# EAGLE board TiLDA Mk2 Prototype v0.1 (EAGLE 6.1), part 1 of 3
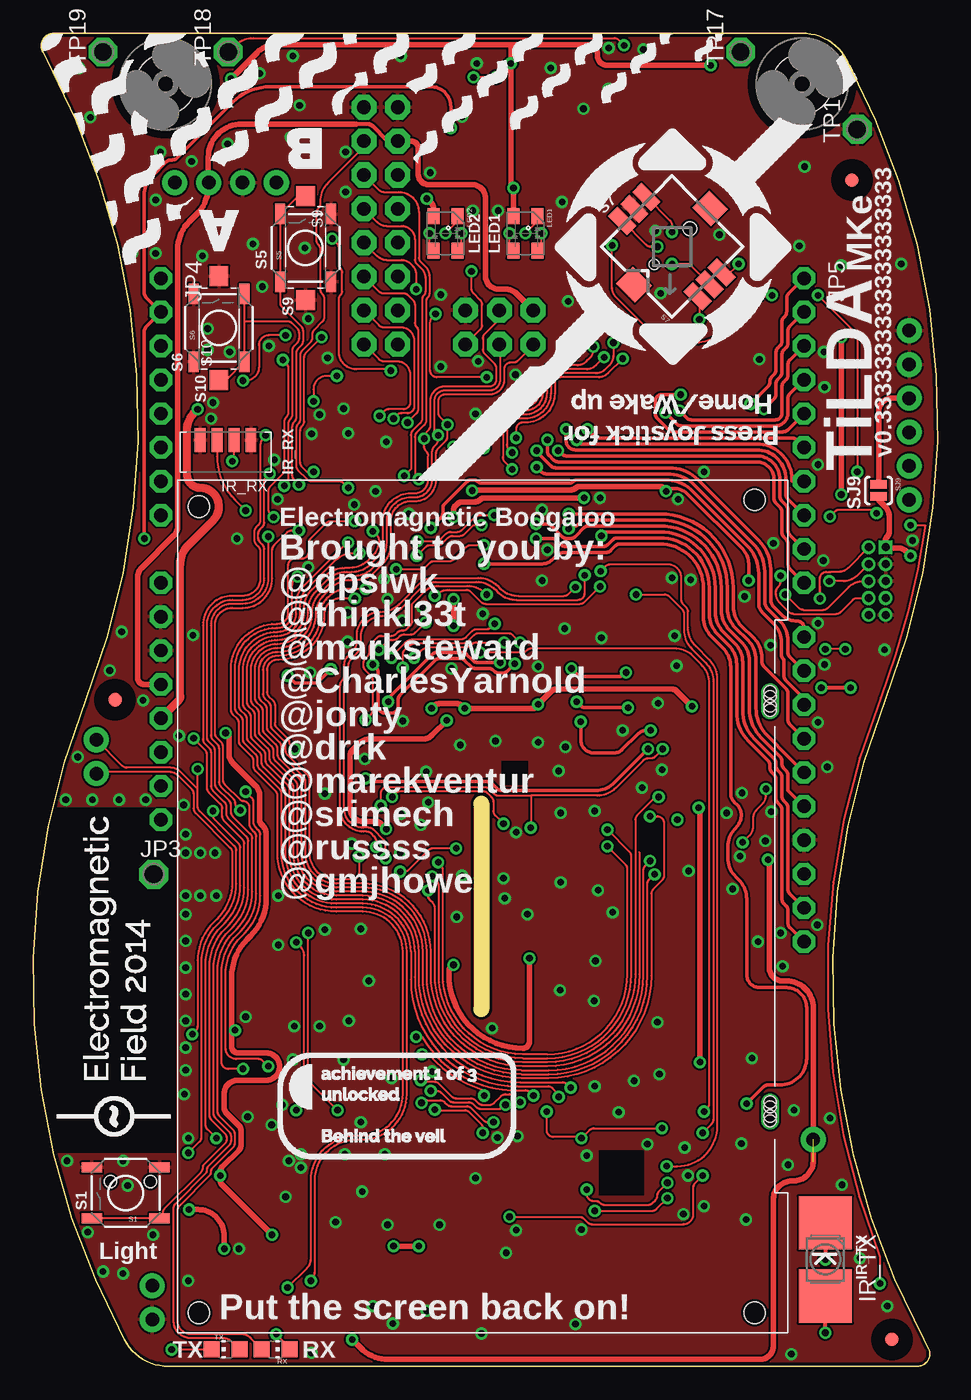
[diagram p5: board, top side]
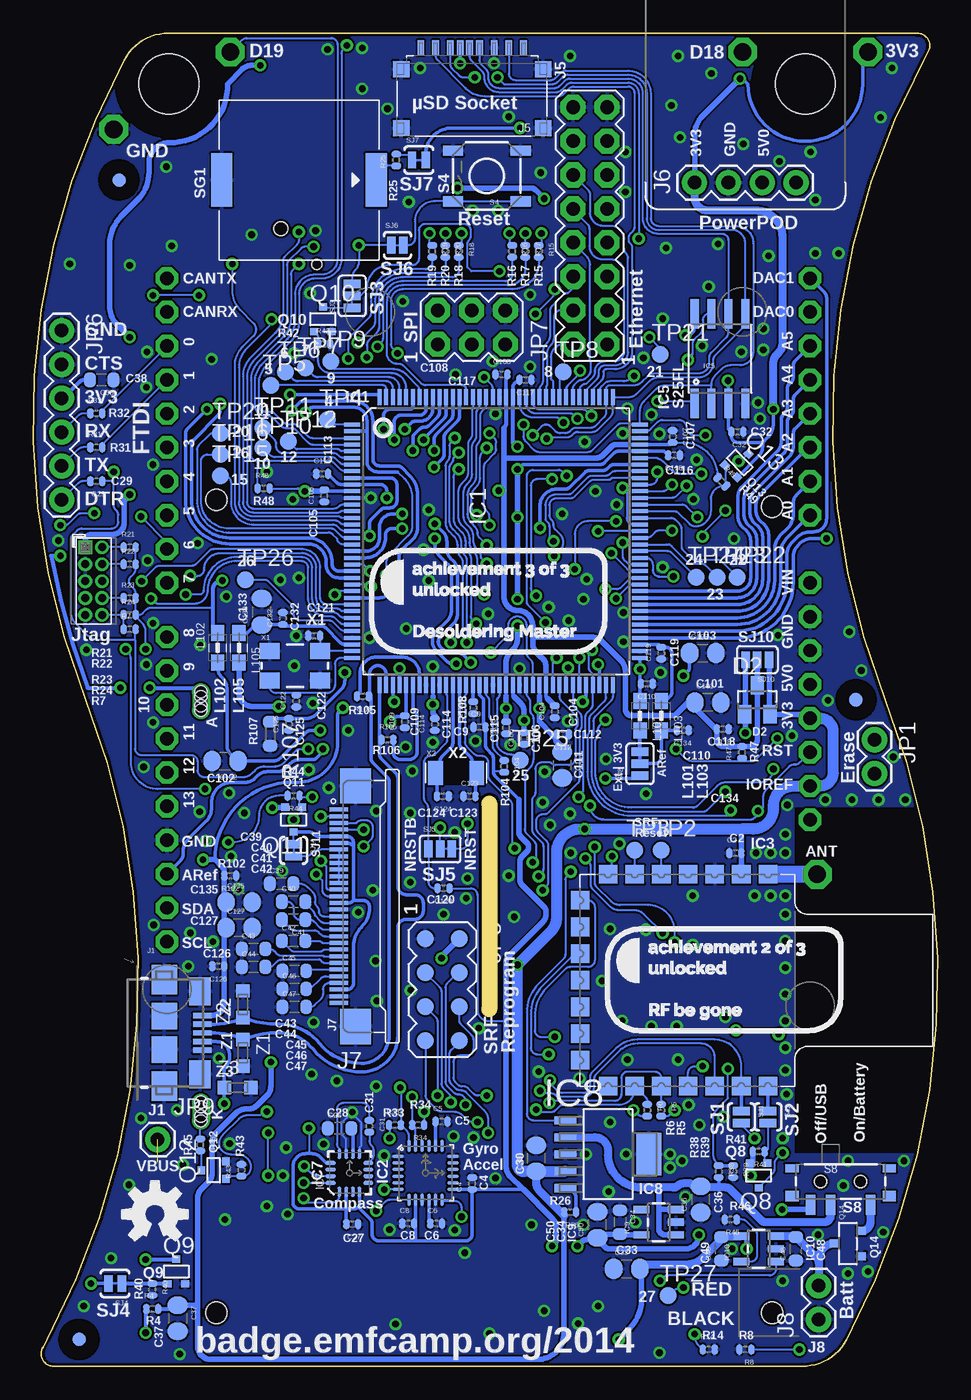
[diagram p6: board, bottom side, seen from below]

Size 67.86 x 100 mm. Coordinates in mm from the lower left corner, seen from the top.
Outline: 33.63,42.2 33.63,26.8
Copper layers (1*2*15*16): Top 0.035mm / dielectric 0.2mm / Route2 0.035mm / dielectric 1mm / Route15 0.035mm / dielectric 0.2mm / Bottom 0.035mm
Design rules: minimum track width 0.15mm, minimum drill 0.3mm, track to track 0.15mm, track to pad 0.15mm, pad to pad 0.15mm, via to via 0.15mm, smd to smd 0.15mm, copper to edge 0.2mm, drill to drill 12mil, minimum pad ring 8mil, minimum via ring 8mil, stop-mask expansion 2mil, vias tented up to drill 25mil, thermal gap 0.15mm
Net classes: 0 default: width 0.15 mm, drill 0.3 mm, clearance 0.15 mm; 1 USB: width 0.254 mm, drill 0.4 mm, clearance 0.2 mm to class 0, clearance 0.4 mm; 2 GND: width 0.3 mm, drill 0.4 mm, clearance 0.2 mm to class 0, clearance 0.2 mm; 3 USBVCC: width 0.6 mm, drill 0.5 mm, clearance 0.2 mm to class 0, clearance 0.2 mm; 4 ANT: width 1.27 mm, drill 0.5 mm, clearance 0.35 mm to class 0, clearance 0.35 mm to class 1, clearance 0.35 mm to class 2, clearance 0.35 mm to class 3, clearance 0.35 mm; 5 CAP: width 0.15 mm, drill 0.5 mm, clearance 0.8 mm to class 0, clearance 0.8 mm to class 1, clearance 0.8 mm to class 2, clearance 0.8 mm to class 3, clearance 0.8 mm to class 4, clearance 0.8 mm
tRestrict: area 0.3,33.9 to 10.7,41.9; area 0.3,16 to 10.7,24
bRestrict: area 0.3,33.9 to 10.7,41.9; area 0.3,16 to 10.7,24

## Footprints (pad centres in the part's own frame; a part is rotated, then mirrored left to right if it is on the bottom)
C0402-ARDUINO-ROUND = smd 0.508 x 0.762: 1 -0.445,0; 2 0.445,0
C0603-ROUND = smd 0.898 x 1.1: 1 -0.889,0; 2 0.889,0
C0805RND = smd 1.3 x 1.5: 1 -0.977,0; 2 0.977,0
C0805RNDPOL = smd 1.3 x 1.5: + -0.977,0; - 0.977,0
SOT23 = smd 1 x 1.4: 1 -0.95,-1.1; 2 0.95,-1.1; 3 0,1.1
FIDUCIAL-1X2.5-STOP = smd 1 x 1: 1 0,0
4,5-LWK = hole 4.5: 0,0
LQFP144 = smd 0.3 x 1.2: 1 -8.75,-10.8; 2 -8.25,-10.8; 3 -7.75,-10.8; 4 -7.25,-10.8; 5 -6.75,-10.8; 6 -6.25,-10.8; 7 -5.75,-10.8; 8 -5.25,-10.8; 9 -4.75,-10.8; 10 -4.25,-10.8; 11 -3.75,-10.8; 12 -3.25,-10.8; 13 -2.75,-10.8; 14 -2.25,-10.8; 15 -1.75,-10.8; 16 -1.25,-10.8; 17 -0.75,-10.8; 18 -0.25,-10.8; 19 0.25,-10.8; 20 0.75,-10.8; 21 1.25,-10.8; 22 1.75,-10.8; 23 2.25,-10.8; 24 2.75,-10.8; 25 3.25,-10.8; 26 3.75,-10.8; 27 4.25,-10.8; 28 4.75,-10.8; 29 5.25,-10.8; 30 5.75,-10.8; 31 6.25,-10.8; 32 6.75,-10.8; 33 7.25,-10.8; 34 7.75,-10.8; 35 8.25,-10.8; 36 8.75,-10.8; 73 8.75,10.8; 74 8.25,10.8; 75 7.75,10.8; 76 7.25,10.8; 77 6.75,10.8; 78 6.25,10.8; 79 5.75,10.8; 80 5.25,10.8; 81 4.75,10.8; 82 4.25,10.8; 83 3.75,10.8; 84 3.25,10.8; 85 2.75,10.8; 86 2.25,10.8; 87 1.75,10.8; 88 1.25,10.8; 89 0.75,10.8; 90 0.25,10.8; 91 -0.25,10.8; 92 -0.75,10.8; 93 -1.25,10.8; 94 -1.75,10.8; 95 -2.25,10.8; 96 -2.75,10.8; 97 -3.25,10.8; 98 -3.75,10.8; 99 -4.25,10.8; 100 -4.75,10.8; 101 -5.25,10.8; 102 -5.75,10.8; 103 -6.25,10.8; 104 -6.75,10.8; 105 -7.25,10.8; 106 -7.75,10.8; 107 -8.25,10.8; 108 -8.75,10.8 | smd 1.2 x 0.3: 37 10.8,-8.75; 38 10.8,-8.25; 39 10.8,-7.75; 40 10.8,-7.25; 41 10.8,-6.75; 42 10.8,-6.25; 43 10.8,-5.75; 44 10.8,-5.25; 45 10.8,-4.75; 46 10.8,-4.25; 47 10.8,-3.75; 48 10.8,-3.25; 49 10.8,-2.75; 50 10.8,-2.25; 51 10.8,-1.75; 52 10.8,-1.25; 53 10.8,-0.75; 54 10.8,-0.25; 55 10.8,0.25; 56 10.8,0.75; 57 10.8,1.25; 58 10.8,1.75; 59 10.8,2.25; 60 10.8,2.75; 61 10.8,3.25; 62 10.8,3.75; 63 10.8,4.25; 64 10.8,4.75; 65 10.8,5.25; 66 10.8,5.75; 67 10.8,6.25; 68 10.8,6.75; 69 10.8,7.25; 70 10.8,7.75; 71 10.8,8.25; 72 10.8,8.75; 109 -10.8,8.75; 110 -10.8,8.25; 111 -10.8,7.75; 112 -10.8,7.25; 113 -10.8,6.75; 114 -10.8,6.25; 115 -10.8,5.75; 116 -10.8,5.25; 117 -10.8,4.75; 118 -10.8,4.25; 119 -10.8,3.75; 120 -10.8,3.25; 121 -10.8,2.75; 122 -10.8,2.25; 123 -10.8,1.75; 124 -10.8,1.25; 125 -10.8,0.75; 126 -10.8,0.25; 127 -10.8,-0.25; 128 -10.8,-0.75; 129 -10.8,-1.25; 130 -10.8,-1.75; 131 -10.8,-2.25; 132 -10.8,-2.75; 133 -10.8,-3.25; 134 -10.8,-3.75; 135 -10.8,-4.25; 136 -10.8,-4.75; 137 -10.8,-5.25; 138 -10.8,-5.75; 139 -10.8,-6.25; 140 -10.8,-6.75; 141 -10.8,-7.25; 142 -10.8,-7.75; 143 -10.8,-8.25; 144 -10.8,-8.75
QFN-24-NODIE = smd 0.85 x 0.25: 1 -2.05,1.25; 2 -2.05,0.75; 3 -2.05,0.25; 4 -2.05,-0.25; 5 -2.05,-0.75; 6 -2.05,-1.25; 13 2.05,-1.25; 14 2.05,-0.75; 15 2.05,-0.25; 16 2.05,0.25; 17 2.05,0.75; 18 2.05,1.25 | smd 0.25 x 0.9: 7 -1.25,-2.025; 8 -0.75,-2.025; 9 -0.25,-2.025; 10 0.25,-2.025; 11 0.75,-2.025; 12 1.25,-2.025; 19 1.25,2.025; 20 0.75,2.025; 21 0.25,2.025; 22 -0.25,2.025; 23 -0.75,2.025; 24 -1.25,2.025
SRF-LANDING-1.2 = smd 1.4 x 1.4: 1 15.9,2; 2 15.9,4; 3 15.9,6; 4 15.9,8; 5 15.9,10; 6 15.9,12; 7 15.9,14; 8 0,14; 9 0,12; 10 0,10; 11 0,8; 12 0,6; 13 0,4; 14 0,2; 15 1.95,-0.1; 16 3.95,-0.1; 17 5.95,-0.1; 18 7.95,-0.1; 19 9.95,-0.1; 20 11.95,-0.1; 21 13.95,-0.1
SO08-EIAJ = smd 0.61 x 2.21: 1 -1.905,-3.378; 2 -0.635,-3.378; 3 0.635,-3.378; 4 1.905,-3.378; 5 1.905,3.353; 6 0.635,3.353; 7 -0.635,3.353; 8 -1.905,3.353
16LPCC = smd 0.75 x 0.28: 1 -1.42,0.75; 2 -1.42,0.25; 3 -1.42,-0.25; 4 -1.42,-0.75; 9 1.42,-0.75; 10 1.42,-0.25; 11 1.42,0.25; 12 1.42,0.75 | smd 0.28 x 0.75: 5 -0.75,-1.42; 6 -0.25,-1.42; 7 0.25,-1.42; 8 0.75,-1.42; 13 0.75,1.42; 14 0.25,1.42; 15 -0.25,1.42; 16 -0.75,1.42
SOT127P700X180-6N = smd 1.626 x 0.61: 1 -3.2,2.54; 2 -3.2,1.27; 3 -3.2,0; 4 -3.2,-1.27; 5 -3.2,-2.54 | smd 1.854 x 3.175: 6 3.073,0
SOT23-5 = smd 0.55 x 1.2: 1 -0.95,-1.3; 2 0,-1.3; 3 0.95,-1.3; 4 0.95,1.3; 5 -0.95,1.3
TSOP75X = smd 0.8 x 1.8: 1 -1.905,-0.9; 2 -0.635,-0.9; 3 0.635,-0.9; 4 1.905,-0.9
P-LCC-2 = smd 4 x 4: A 0,2.75; C 0,-2.75
USB-AB-MICRO-SMD_LWK = smd 1.4 x 0.4: D+ 2.85,0; D- 2.85,0.65; GND 2.85,-1.3; ID 2.85,-0.65; VBUS 2.85,1.3 | smd 1.6 x 2.1: P$1 2.675,3.1; P$2 2.675,-3.1 | smd 1.9 x 2: P$6 0,1.25; P$7 0,-1.25 | smd 1.9 x 2.2: P$8 0,4; P$9 0,-4
ARDUINOR3-LWKTXT-REF-SPI = drill 1 pad 1.676 octagon: 3V 35.56,2.54; 5V 38.1,2.54; !RESET 33.02,2.54; A0 50.8,2.54; A1 53.34,2.54; A2 55.88,2.54; A3 58.42,2.54; A4 60.96,2.54; A5 63.5,2.54; AREF 23.876,50.8; D0 63.5,50.8; D1 60.96,50.8; D2 58.42,50.8; D3 55.88,50.8; D4 53.34,50.8; D5 50.8,50.8; D6 48.26,50.8; D7 45.72,50.8; D8 41.656,50.8; D9 39.116,50.8; D10 36.576,50.8; D11 34.036,50.8; D12 31.496,50.8; D13 28.956,50.8; GND@1 43.18,2.54; GND@2 40.64,2.54; GND@3 26.416,50.8; IOREF 30.48,2.54; RESERVED 27.94,2.54; SCL 18.796,50.8; SDA 21.336,50.8; VIN 45.72,2.54 | drill 1.016 pad 1.88 octagon: 5V@ISP 66.167,30.48; !RESET@ISP 63.627,25.4; GND@ISP 66.167,25.4; MISO 63.627,30.48; MOSI 66.167,27.94; SCK 63.627,27.94
105027-LWK = smd 0.5 x 1.1: G1 0.2,-3.925; P1 3.85,-3.925; P2 2.75,-3.925; P3 1.65,-3.925; P4 0.9,-3.925; P5 -0.55,-3.925; P6 -1.65,-3.925; P7 -2.75,-3.925; P8 -3.85,-3.925 | smd 1.25 x 1.2: PAD@1 -5.325,2.125; PAD@2 5.325,2.125; PAD@3 -5.325,-2.325; PAD@4 5.325,-2.325
POWER-POD-EMF = drill 1.016 pad 1.88: 1 -3.81,0; 2 -1.27,0; 3 1.27,0; 4 3.81,0
SFV30R-2STE1HLF = smd 0.3 x 1.4: 1 -7.25,-2.8; 2 -6.75,-2.8; 3 -6.25,-2.8; 4 -5.75,-2.8; 5 -5.25,-2.8; 6 -4.75,-2.8; 7 -4.25,-2.8; 8 -3.75,-2.8; 9 -3.25,-2.8; 10 -2.75,-2.8; 11 -2.25,-2.8; 12 -1.75,-2.8; 13 -1.25,-2.8; 14 -0.75,-2.8; 15 -0.25,-2.8; 16 0.25,-2.8; 17 0.75,-2.8; 18 1.25,-2.8; 19 1.75,-2.8; 20 2.25,-2.8; 21 2.75,-2.8; 22 3.25,-2.8; 23 3.75,-2.8; 24 4.25,-2.8; 25 4.75,-2.8; 26 5.25,-2.8; 27 5.75,-2.8; 28 6.25,-2.8; 29 6.75,-2.8; 30 7.25,-2.8 | smd 2.65 x 2.3: M1 9.025,-1.55; M2 -9.025,-1.55
1X02_RA = drill 1.016 pad 1.88: 1 0,0; 2 2.54,0
1X02 = drill 1.016 pad 1.88: 1 0,0; 2 2.54,0
PINHEAD_2X05_127 = drill 0.6 pad 1.016 square: 1 -0.635,2.54 | drill 0.6 pad 1.016: 2 0.635,2.54; 3 -0.635,1.27; 4 0.635,1.27; 5 -0.635,0; 6 0.635,0; 7 -0.635,-1.27; 8 0.635,-1.27; 9 -0.635,-2.54; 10 0.635,-2.54
P1-13 = drill 1.321 pad 2.159 octagon: TP 0,0
1X02_NO_SILK_OCT = drill 1.016 pad 1.676 octagon: 1 0,0; 2 2.54,0
1X06 = drill 1.016 pad 1.88: 1 0,0; 2 2.54,0; 3 5.08,0; 4 7.62,0; 5 10.16,0; 6 12.7,0
2X8 = drill 1.016 pad 1.88 octagon: 1 0,0; 2 0,2.54; 3 2.54,0; 4 2.54,2.54; 5 5.08,0; 6 5.08,2.54; 7 7.62,0; 8 7.62,2.54; 9 10.16,0; 10 10.16,2.54; 11 12.7,0; 12 12.7,2.54; 13 15.24,0; 14 15.24,2.54; 15 17.78,0; 16 17.78,2.54
2X4-PAD = smd 1.27 x 1.27: 1 -3.81,-1.27; 2 -3.81,1.27; 3 -1.27,-1.27; 4 -1.27,1.27; 5 1.27,-1.27; 6 1.27,1.27; 7 3.81,-1.27; 8 3.81,1.27
1X01 = drill 1.016 pad 1.88: 1 0,0
WUERTH-0805 = smd 1.2 x 1: 1 -1.1,0; 2 1.1,0
LED-RGB_CLV1A-FKB = smd 1.2 x 0.9: A -1.3,-0.9; B 1.3,-0.9; G 1.3,0.9; R -1.3,0.9
SC70-3-R = smd 0.6 x 0.55: 1 -0.65,-0.925; 2 0.65,-0.925; 3 0,0.925
SOT23-R = smd 0.6 x 0.7: 1 -0.95,-1; 2 0.95,-1; 3 0,1
R0402-ARDUINO-ROUND = smd 0.508 x 0.762: 1 -0.445,0; 2 0.445,0
R0603-ROUND = smd 0.898 x 1.1: 1 -0.889,0; 2 0.889,0
LED-0805-CORRECT = smd 1.2 x 1.2: A 1.05,0; C -1.05,0
TACTILE_SWITCH_SMD = smd 1.524 x 0.762: 1 -2.54,1.905; 2 2.54,1.905; 3 -2.54,-1.905; 4 2.54,-1.905
JOYSTICK_MULTICOMP = smd 2 x 1: A -4,1.275; B 4,1.275; C -4,-1.275; CTR -4,0; D 4,-1.275; GND 4,0 | smd 2 x 1.8: NC 0,4.05; NC@0 0,-4.05 | hole 0.75: 0,1.9 | hole 1.05: 0,-1.9
SWITCH-SPST-SMD-A = smd 0.7 x 1.5: 1 -2.25,-1.75; 2 -0.75,-1.75; 3 2.25,-1.75 | smd 1 x 0.6: GND1 -3.65,1; GND3 3.65,1 | smd 1 x 0.8: GND2 -3.65,-1.1; GND4 3.65,-1.1 | hole 0.9: -1.5,0; 1.5,0
TACTILE_SWITCH_SMD_3X6X2.5H = smd 1.5 x 1.4: 1 -3.9,0; 2 3.9,0
BUZZER-PKLCS1212E = smd 1.6 x 4: P$1 -5.8,0; P$2 5.8,0
SJ_2S-NO = smd 0.635 x 1.27: 1 -0.45,0; 2 0.45,0
SJ_3 = smd 0.635 x 1.27: 1 -0.889,0; 2 0,0; 3 0.889,0
SJ_2S-TRACE = smd 0.635 x 1.27: 1 -0.508,0; 2 0.508,0
B1,27 = smd 1.27 x 1.27: TP 0,0
JHD12864-G13BSW-OUTLINE = drill 0.9 long: A 47.4,1.35; K 16.6,1.35 | hole 1.6: 1.5,2.5; 62.5,2.5; 1.5,44.2; 62,44.2 | hole 0.9: 48.1,1.35; 46.7,1.35; 16.95,1.35; 15.9,1.35; 47.75,1.35; 47.05,1.35; 17.3,1.35; 16.25,1.35
CRYSTAL-5X3.2 = smd 1.5 x 1.2: 1 -1.9,-1.1; 2 1.9,-1.1; 3 1.9,1.1; 4 -1.9,1.1
RESONATOR_EPSON_FC_145 = smd 1.1 x 1.8: P$1 -1.55,0; P$2 1.55,0
CT/CN0603 = smd 1 x 1: 1 -1,0; 2 1,0

## Placement (x,y rotation side)
ARTWORK1  ARTWORK_FRONT1  [TILDA_ARTWORK_FRONT1]  -0.07,0 0 top
ARTWORK2  ARTWORK_ACHIEVEMENT2  [TILDA_ARTWORK_ACHIEVEMENT2]  24.93,25 0 bottom
ARTWORK3  ARTWORK_ACHIEVEMENT3  [TILDA_ARTWORK_ACHIEVEMENT3]  42.63,53.4 0 bottom
C2  0402/100n/10V/X5R  [C0402-ARDUINO-ROUND]  15.18,38.5 0 bottom
C4  0402/100n/10V/X5R  [C0402-ARDUINO-ROUND]  34.93,13.7 90 bottom
C5  0402/2n2/50V/X7R  [C0402-ARDUINO-ROUND]  37.23,18.35 0 bottom
C6  0402/100n/10V/X5R  [C0402-ARDUINO-ROUND]  37.63,10.7 0 bottom
C8  0402/10n/4V/X7R  [C0402-ARDUINO-ROUND]  39.73,10.7 0 bottom
C9  0402/100n/10V/X5R  [C0402-ARDUINO-ROUND]  34.38,47.95 0 bottom
C27  0402/100n/10V/X5R  [C0402-ARDUINO-ROUND]  43.93,10.65 180 bottom
C28  0603/4u7/6V3/Y5V  [C0603-ROUND]  44.88,17.85 0 bottom
C29  0402/100n/10V/X5R  [C0402-ARDUINO-ROUND]  63.13,66.4 180 bottom
C30  0805/10u/6V3/X5R  [C0805RND]  30.13,15.6 90 bottom
C31  0402/0u22/10V/X5R  [C0402-ARDUINO-ROUND]  42.63,18 270 bottom
C32  0402/100n/10V/X5R  [C0402-ARDUINO-ROUND]  15.03,70.1 180 bottom
C33  0805/10u/6V3/X5R  [C0805RND]  23.33,7.3 0 bottom
C34  0603/1u/10V/X5R  [C0603-ROUND]  23.83,10.8 270 bottom
C36  0805/10u/6V3/X5R  [C0805RND]  17.78,12.5 90 bottom
C37  0805/10u/6V3/X5R  [C0805RND]  57.03,3.6 270 bottom
C38  0603/1u/10V/X5R  [C0603-ROUND]  62.73,74 180 bottom
C39  0603/1u/10V/X5R  [C0603-ROUND]  49.23,36.2 0 bottom
C40  0603/1u/10V/X5R  [C0603-ROUND]  48.33,34.85 0 bottom
C41  0603/1u/10V/X5R  [C0603-ROUND]  48.33,33.5 180 bottom
C42  0603/1u/10V/X5R  [C0603-ROUND]  48.33,31.9 0 bottom
C43  0603/1u/10V/X5R  [C0603-ROUND]  51.33,31.3 0 bottom
C44  0603/1u/10V/X5R  [C0603-ROUND]  51.33,29.95 0 bottom
C45  0603/1u/10V/X5R  [C0603-ROUND]  48.28,29.65 0 bottom
C46  0603/1u/10V/X5R  [C0603-ROUND]  48.28,28.3 0 bottom
C47  0603/1u/10V/X5R  [C0603-ROUND]  48.28,26.95 0 bottom
C48  0603/4u7/6V3/Y5V  [C0603-ROUND]  10.63,8.8 90 bottom
C49  0603/4u7/6V3/Y5V  [C0603-ROUND]  16.23,8.8 90 bottom
C50  0805/10u/6V3/X5R  [C0805RNDPOL]  25.53,10.6 90 bottom
C101  0805/10u/6V3/X5R  [C0805RNDPOL]  17.23,49.8 0 bottom
C102  0805/10u/6V3/X5R  [C0805RNDPOL]  53.48,45.4 180 bottom
C103  0805/10u/6V3/X5R  [C0805RNDPOL]  17.63,53.5 0 bottom
C104  0402/100n/10V/X5R  [C0402-ARDUINO-ROUND]  28.73,49.1 90 bottom
C105  0402/100n/10V/X5R  [C0402-ARDUINO-ROUND]  46.03,65.3 90 bottom
C106  0402/100n/10V/X5R  [C0402-ARDUINO-ROUND]  31.03,47.1 90 bottom
C107  0402/100n/10V/X5R  [C0402-ARDUINO-ROUND]  19.88,69.75 270 bottom
C108  0402/100n/10V/X5R  [C0402-ARDUINO-ROUND]  32.73,74.4 0 bottom
C109  0402/100n/10V/X5R  [C0402-ARDUINO-ROUND]  39.98,48.35 90 bottom
C110  0402/100n/10V/X5R  [C0402-ARDUINO-ROUND]  21.83,51.2 180 bottom
C111  0805/10u/6V3/X5R  [C0805RNDPOL]  28.18,45.1 270 bottom
C112  0402/100n/10V/X5R  [C0402-ARDUINO-ROUND]  28.13,47.4 180 bottom
C113  0402/100n/10V/X5R  [C0402-ARDUINO-ROUND]  46.18,66.95 0 bottom
C114  0402/100n/10V/X5R  [C0402-ARDUINO-ROUND]  37.73,48.15 90 bottom
C115  0402/100n/10V/X5R  [C0402-ARDUINO-ROUND]  32.38,47.9 90 bottom
C116  0402/100n/10V/X5R  [C0402-ARDUINO-ROUND]  19.78,68.35 180 bottom
C117  0402/100n/10V/X5R  [C0402-ARDUINO-ROUND]  30.93,74 180 bottom
C118  0402/100n/10V/X5R  [C0402-ARDUINO-ROUND]  16.13,47.8 180 bottom
C119  0402/100n/10V/X5R  [C0402-ARDUINO-ROUND]  20.73,53.5 90 bottom
C120  0402/10n/10v/Y5V  [C0402-ARDUINO-ROUND]  37.08,35.85 180 bottom
C121  0402/7p/  [C0402-ARDUINO-ROUND]  46.78,54.8 0 bottom
C122  0402/7p/  [C0402-ARDUINO-ROUND]  48.13,49.9 90 bottom
C123  0402/15p/  [C0402-ARDUINO-ROUND]  35.13,42.75 0 bottom
C124  0402/15p/  [C0402-ARDUINO-ROUND]  37.13,42.75 180 bottom
C125  0402/15p/  [C0402-ARDUINO-ROUND]  48.68,48.15 90 bottom
C126  0402/10n/10V/Y5V  [C0402-ARDUINO-ROUND]  53.98,30 180 bottom
C127  0805/10u/6V3/X5R/(NP)  [C0805RNDPOL]  52.43,32.9 0 bottom
C132  0402/100n/10V/X5R  [C0402-ARDUINO-ROUND]  49.13,56.1 90 bottom
C133  0805/10u/6V3/X5R  [C0805RNDPOL]  50.73,56.6 90 bottom
C134  0402/100n/10V/X5R  [C0402-ARDUINO-ROUND]  19.13,47.7 180 bottom
C135  0805/10u/6V3/X5R/(NP)  [C0805RNDPOL]  52.43,34.8 0 bottom
D2  BAT54C  [SOT23]  13.53,50 0 bottom
FID1  FIDUCIAL1X2.5-STOP  [FIDUCIAL-1X2.5-STOP]  6.13,50 270 top
FID2  FIDUCIAL1X2.5-STOP  [FIDUCIAL-1X2.5-STOP]  64.43,2 270 top
FID3  FIDUCIAL1X2.5-STOP  [FIDUCIAL-1X2.5-STOP]  61.43,89 90 bottom
FID4  FIDUCIAL1X2.5-STOP  [FIDUCIAL-1X2.5-STOP]  61.43,89 270 top
FID5  FIDUCIAL1X2.5-STOP  [FIDUCIAL-1X2.5-STOP]  64.43,2 90 bottom
FID6  FIDUCIAL1X2.5-STOP  [FIDUCIAL-1X2.5-STOP]  6.13,50 90 bottom
H1  [4,5-LWK]  9.93,96.2 0 top
H2  [4,5-LWK]  57.68,96.2 0 top
IC1  ATSAM3X8EA-AU  [LQFP144]  33.13,61.9 270 bottom
IC2  MPU-6050  [QFN-24-NODIE]  38.43,14.5 0 bottom
IC3  SRF-V1.2  [SRF-LANDING-1.2]  26.73,36.9 270 bottom
IC5  S25FL216K0PMFI011  [SO08-EIAJ]  16.33,75.6 0 bottom
IC7  HMC5883LSMD (NP)  [16LPCC]  44.13,14.5 90 bottom
IC8  MCP1825T-3302E/DC  [SOT127P700X180-6N]  24.73,15.9 0 bottom
IC9  TC1015-3V3  [SOT23-5]  20.93,10.8 90 bottom
IC10  MCP73831  [SOT23-5]  13.43,8.8 90 bottom
IR_RX  TSOP75238TT  [TSOP75X]  14.43,68.6 180 top
IR_TX  VSMB3940X01-GS08  [P-LCC-2]  59.43,8 180 top
J1  ZX62-AB-5PA(11)  [USB-AB-MICRO-SMD_LWK]  58.03,25 0 bottom
J3  Arduino Headers  [ARDUINOR3-LWKTXT-REF-SPI]  7.03,13.05 90 bottom
J5  1050270001 (NP)  [105027-LWK]  34.93,95 180 bottom
J6  B016 - PowerPOD NCP1402 5V0  [POWER-POD-EMF]  14.43,88.8 0 bottom
J7  SFV30R-2STE1HLF  [SFV30R-2STE1HLF]  42.13,34.5 270 bottom
J8  1x02 RA Pin  [1X02_RA]  8.93,3.5 90 bottom
JP1  ERASE  [1X02]  4.73,47 270 bottom
JP2  JTAG M50-3500542  [PINHEAD_2X05_127]  63.33,58.9 0 bottom
JP3  ANT  [P1-13]  9.03,36.9 0 top
JP4  DAC  [1X02_NO_SILK_OCT]  9.57,81.63 270 top
JP5  CAN  [1X02_NO_SILK_OCT]  57.83,81.63 270 top
JP6  FTDI  [1X06]  65.73,77.7 270 bottom
JP7  ETH  [2X8]  24.81,76.68 90 bottom
JP8  SRF Reprogram  [2X4-PAD]  37.18,28.25 270 bottom
JP9  VBUS  [1X01]  58.53,17 0 bottom
L101  MH2029-300Y  [WUERTH-0805]  22.33,48.8 90 bottom
L102  MH2029-300Y  [WUERTH-0805]  54.03,53.9 270 bottom
L103  MH2029-300Y  [WUERTH-0805]  20.73,48.8 90 bottom
L105  MH2029-300Y  [WUERTH-0805]  52.43,53.9 90 bottom
LED1  CLV1A-FKB  [LED-RGB_CLV1A-FKB]  36.93,85 270 top
LED2  CLV1A-FKB  [LED-RGB_CLV1A-FKB]  30.93,85 270 top
LOGO1  OSHW-LOGOM  [OSHW-LOGO-M]  58.73,11.4 0 bottom
OUTLINE1  TILDA_BOARDOUTLINE-MITER  [TILDA_BADGEBOARDBARE-VERYWIDE-MITER]  -0.07,100 270 top
Q8  BSS84W  [SC70-3-R]  13.43,14.3 180 bottom
Q9  2N7002KW  [SC70-3-R]  57.13,7.1 0 bottom
Q10  2N7002KW  [SC70-3-R]  46.13,78.55 0 bottom
Q11  BSS84W  [SC70-3-R]  48.33,41 180 bottom
Q12  2N7002KW  [SC70-3-R]  54.33,14.7 90 bottom
Q13  BSS84W  [SC70-3-R]  14.85,67.8 315 bottom
Q14  NTR1P02T1G  [SOT23-R]  6.73,9.2 90 bottom
R4  0402/20R/5%  [R0402-ARDUINO-ROUND]  58.93,4.3 0 bottom
R5  0402/0R/5%  [R0402-ARDUINO-ROUND]  20.73,19.2 270 bottom
R6  0402/0R/5%  [R0402-ARDUINO-ROUND]  21.78,19.2 270 bottom
R7  0402/0R/5%  [R0402-ARDUINO-ROUND]  60.63,55.3 0 bottom
R8  0402/1K/5%  [R0402-ARDUINO-ROUND]  14.43,1.25 180 bottom
R14  0402/1K/5%  [R0402-ARDUINO-ROUND]  17.18,1.25 0 bottom
R15  0402/12R/5%  [R0402-ARDUINO-ROUND]  29.93,83.65 270 bottom
R16  0402/12R/5%  [R0402-ARDUINO-ROUND]  31.93,83.65 270 bottom
R17  0402/82R/5%  [R0402-ARDUINO-ROUND]  30.93,83.65 270 bottom
R18  0402/12R/5%  [R0402-ARDUINO-ROUND]  35.93,83.65 270 bottom
R19  0402/12R/5%  [R0402-ARDUINO-ROUND]  37.93,83.65 270 bottom
R20  0402/82R/5%  [R0402-ARDUINO-ROUND]  36.93,83.65 270 bottom
R21  0402/100K/1%  [R0402-ARDUINO-ROUND]  60.63,61.44 0 bottom
R22  0402/100K/1%  [R0402-ARDUINO-ROUND]  60.63,60.17 0 bottom
R23  0402/100K/1%  [R0402-ARDUINO-ROUND]  60.63,57.63 0 bottom
R24  0402/100K/1%  [R0402-ARDUINO-ROUND]  60.63,56.36 0 bottom
R25  0402/1K/5%  [R0402-ARDUINO-ROUND]  40.63,90.5 90 bottom
R26  0402/10K/5%  [R0402-ARDUINO-ROUND]  27.58,11.55 180 bottom
R31  0402/0R/5%  [R0402-ARDUINO-ROUND]  63.13,68.94 0 bottom
R32  0402/0R/5%  [R0402-ARDUINO-ROUND]  63.13,71.48 0 bottom
R33  0402/1K5/5%  [R0402-ARDUINO-ROUND]  40.73,18.1 0 bottom
R34  0402/1K5/5%  [R0402-ARDUINO-ROUND]  38.98,18.1 180 bottom
R38  0402/100K/5%  [R0402-ARDUINO-ROUND]  16.43,14.6 270 bottom
R39  0402/100K/5%  [R0402-ARDUINO-ROUND]  15.33,14.6 270 bottom
R40  0402/10K/5%  [R0402-ARDUINO-ROUND]  58.93,5.75 270 bottom
R41  0402/10K/5%  [R0402-ARDUINO-ROUND]  13.43,16.1 180 bottom
R42  0402/10K/5%  [R0402-ARDUINO-ROUND]  46.03,76.7 0 bottom
R43  0402/10K/5%  [R0402-ARDUINO-ROUND]  52.23,14.7 90 bottom
R44  0402/10K/5%  [R0402-ARDUINO-ROUND]  48.33,42.8 180 bottom
R45  0402/12R/5%  [R0402-ARDUINO-ROUND]  55.33,16.6 270 bottom
R46  0402/2K/5%  [R0402-ARDUINO-ROUND]  15.53,11 180 bottom
R47  0402/10K/5%  [R0402-ARDUINO-ROUND]  14.68,46.05 90 bottom
R48  0402/10K/5%  [R0402-ARDUINO-ROUND]  50.58,65.85 0 bottom
R49  0402/10K/5%  [R0402-ARDUINO-ROUND]  16.19,66.36 315 bottom
R102  0402/10K/5%  [R0402-ARDUINO-ROUND]  53.08,36.8 180 bottom
R104  0402/100K/1%  [R0402-ARDUINO-ROUND]  32.53,45 270 bottom
R105  0402/39R/1%  [R0402-ARDUINO-ROUND]  43.13,50.25 180 bottom
R106  0402/39R/1%  [R0402-ARDUINO-ROUND]  41.28,47 0 bottom
R107  0603/6K8/1%  [R0603-ROUND]  50.08,47.45 270 bottom
R108  0402/0R/5%/(NP)  [R0402-ARDUINO-ROUND]  34.83,49.4 90 bottom
RX  0603/LED/RED  [LED-0805-CORRECT]  18.18,1.25 180 top
S1  SKQGAKE010  [TACTILE_SWITCH_SMD]  6.93,13 180 top
S4  SKQGAKE010  [TACTILE_SWITCH_SMD]  33.83,89.3 180 bottom
S5  SKQGAKE010  [TACTILE_SWITCH_SMD]  20.43,83.9 90 top
S6  SKQGAKE010  [TACTILE_SWITCH_SMD]  13.93,77.9 90 top
S7  SKRHAAE010  [JOYSTICK_MULTICOMP]  47.93,84 135 top
S8  CUS-12TB  [SWITCH-SPST-SMD-A]  7.28,13.85 0 bottom
S9  3x6x2.5  [TACTILE_SWITCH_SMD_3X6X2.5H]  20.43,83.9 270 top
S10  3x6x2.5  [TACTILE_SWITCH_SMD_3X6X2.5H]  13.93,77.9 90 top
SG1  PKLCS1212E4001-R1  [BUZZER-PKLCS1212E]  47.93,89 180 bottom
SJ1  SRF RESET  [SJ_2S-NO]  14.73,18.7 270 bottom
SJ2  SRF ERASE  [SJ_2S-NO]  12.73,18.7 270 bottom
SJ3  ISP_RESET  [SJ_3]  43.93,80.3 90 bottom
SJ4  IR_TX  [SJ_2S-TRACE]  61.73,6.2 180 bottom
SJ5  RESET SELECT  [SJ_3]  37.33,38.8 0 bottom
SJ6  RESET BUTTON  [SJ_2S-NO]  40.53,84.1 0 bottom
SJ7  Buzzer  [SJ_2S-TRACE]  38.93,90.5 0 bottom
SJ8  AREF  [SJ_3]  22.33,45.2 90 bottom
SJ9  FTDI Power  [SJ_2S-NO]  63.43,65.7 270 top
SJ10  VDDIO  [SJ_3]  13.53,53 180 bottom
SJ11  D0-5  [SJ_2S-NO]  48.33,38.7 270 bottom
TP1  GND  [P1-13]  61.83,92.8 90 top
TP2  SRF Reset  [B1,27]  20.73,38.7 0 bottom
TP3  SRF Reset  [B1,27]  22.73,38.7 0 bottom
TP4  D22  [B1,27]  45.78,71 0 bottom
TP5  PB24  [B1,27]  50.03,73.6 0 bottom
TP6  SS3  [B1,27]  48.93,74.6 0 bottom
TP7  PB22  [B1,27]  47.43,74.9 0 bottom
TP8  PC10  [B1,27]  28.08,74.6 0 bottom
TP9  PC27  [B1,27]  45.53,75.4 0 bottom
TP10  D23  [B1,27]  50.63,68.9 0 bottom
TP11  TXD1  [B1,27]  50.63,70.4 0 bottom
TP12  RXD1  [B1,27]  48.73,69.4 0 bottom
TP15  TXD0  [B1,27]  53.83,66.8 0 bottom
TP16  RXD0  [B1,27]  53.83,68.4 0 bottom
TP17  D19  [P1-13]  53.08,98.6 90 top
TP18  D18  [P1-13]  14.63,98.6 90 top
TP19  3V3  [P1-13]  5.23,98.6 90 top
TP20  PD6  [B1,27]  53.83,70 0 bottom
TP21  PC17  [B1,27]  20.83,75.9 0 bottom
TP22  PC12  [B1,27]  15.03,59.2 0 bottom
TP23  PB19  [B1,27]  16.53,59.2 0 bottom
TP24  PB18  [B1,27]  18.13,59.2 0 bottom
TP25  PC1  [B1,27]  31.33,45.45 0 bottom
TP26  PD10  [B1,27]  51.93,59 0 bottom
TP27  PB10  [B1,27]  20.23,5.3 0 bottom
TX  0603/LED/RED  [LED-0805-CORRECT]  14.43,1.25 0 top
U2  JHD12864-G13BSW-OUTLINE  [JHD12864-G13BSW-OUTLINE]  56.63,2.5 90 top
X1  12Mhz 13pF 30ppm (7pf caps)  [CRYSTAL-5X3.2]  48.23,52.55 0 bottom
X2  32.768Khz  [RESONATOR_EPSON_FC_145]  36.13,44.5 0 bottom
Z1  CG0603MLC-05E  [CT/CN0603]  52.13,23.5 270 bottom
Z2  CG0603MLC-05E  [CT/CN0603]  52.13,27.15 90 bottom
Z3  CG0603MLC-05E  [CT/CN0603]  52.53,20.9 0 bottom

## Tracks (layer width: path | path; a pad name or v marks a point on that pad's centre or on a via)
3V3  (via drill 0.5)
  Top 0.15: v18.93,77.35 17.68,77.35 arc90 16.93,76.6 16.93,74.95 arc-90 15.93,73.95 v15.73,73.95
  Top 0.305: v61.33,50.9 v59.13,50.9
  Top 0.406: 35.83,99.15 41.58,99.15 arc-90 42.33,98.4 42.33,98.35 arc90 43.08,97.6 v50.83,97.6 | v60.63,77.2 v60.63,65.4 | v29.53,87.6 29.88,87.25 arc-45 30.03,86.9 LED2.A | LED1.A v36.03,88.4 35.83,88.6 v35.83,97.75 35.83,99.15 | v26.48,40.3 26.07,40.71 arc45 25.72,40.85 24.78,40.85 arc-90 23.78,41.85 23.78,45.8 arc-45 23.92,46.2 24.49,46.76 arc-45 25.19,47.05 29.21,47.05 arc45 29.92,47.35 v31.03,48.45 | SJ9.2 63.43,65 63.94,64.5 arc-45 64.23,63.79 64.23,62.61 arc-45 64.08,62.26 64.07,62.25 arc45 63.93,61.9 63.93,61.48 JP2.1 64,61.4 64.81,61.4 arc-45 65.52,61.11 v65.83,60.8 | v14.83,96.6 16.79,98.57 arc-45 18.21,99.15 35.83,99.15 | v50.03,22.8 50.03,41.8 v49.93,41.9 | v37.23,30.6 37.23,24.35 arc-90 36.73,23.85 arc-90 31.18,29.4 31.18,29.75 v31.53,30.1
  Top 0.61: J3.3V 10.88,49.93 arc45 11.03,50.28 11.03,60.17 arc-45 11.61,61.59 13.52,63.49 arc45 13.93,64.48 13.93,64.5 arc90 12.53,65.9 arc-90 11.53,66.9 11.53,70.17 arc-45 12.11,71.59 v12.33,71.8
  Bottom 0.15: v18.93,77.35 18.73,77.35 arc-90 18.23,77.85 IC5.8 | Q13.2 15.33,66.69 | Q11.2 48.77,42.13
  Bottom 0.254: 28.03,11.3 R26.2 | 31.78,50.25 31.88,50.35 IC1.57 | J5.P4 v35.83,97.75 | TP19.TP 5.63,98.2 5.63,96.2 arc180 14.23,96.2 14.63,96.6 v14.83,96.6 | Q13.2 13.42,68.31 arc-45 13.13,69.01 13.13,69.3 | v12.33,71.8 12.33,70.72 arc45 12.77,69.66 13.13,69.3 | 13.13,69.3 14.98,69.3 arc90 15.48,69.8 C32.2 15.69,70.32 IC5.3 15.69,73.92 v15.73,73.95 | J6.1
  Bottom 0.305: R4.2 57.03,4.3 | U2.A 55.28,50.9 v59.13,50.9 | v65.83,60.8 66.53,60.8 arc-10 63.78,50.9 v61.33,50.9
  Bottom 0.406: v50.83,97.6 51.46,97.6 arc-45 52.17,97.31 53.28,96.2 arc93 57.68,91.8 arc-90 59.18,90.3 59.18,89.6 arc45 60.06,87.47 61.25,86.28 arc-45 62.13,84.16 62.13,79.53 arc-45 61.54,78.12 v60.63,77.2 | v60.63,65.4 60.88,65.15 arc-45 61.03,64.8 61.03,63.3 arc90 61.93,62.4 63.46,62.4 arc-90 63.96,61.9 JP2.1 | 14.73,40.3 C2.2 | C2.2 IC3.9 | C2.2 | v36.03,88.4 30.54,88.4 arc45 30.18,88.26 v29.53,87.6 | 28.03,11.3 28.03,2.5 arc90 30.03,0.5 54.53,0.5 arc90 55.53,1.5 55.53,4.58 | C106.2 v31.03,48.45 31.03,49.09 arc-45 31.32,49.8 31.78,50.25 | 30.63,14.6 30.63,14.63 C30.1 29.81,14.63 | 55.53,4.58 C37.1 57.03,4.3 | 55.53,4.58 55.53,12.59 arc45 55.24,13.3 54.72,13.81 arc-45 54.43,14.52 54.43,16.79 arc45 54.14,17.5 52.62,19.01 arc45 51.91,19.3 51.74,19.3 arc-45 51.04,19.6 50.32,20.31 arc-45 50.03,21.02 v50.03,22.8 | v49.93,41.9 49,41.9 Q11.2 | v14.83,96.6 17.64,93.79 arc-45 18.23,92.37 J6.1 | JP8.2 37.23,30.74 v37.23,30.6 | SJ10.1 12.64,48.96 D2.2 9.93,48.9 9.63,48.6 J3.3V
  Bottom 0.61: C30.1 30.13,13.82 arc-45 29.84,13.11 28.03,11.3 | v12.33,71.8 12.33,75.24 arc45 12.04,75.95 11.92,76.06 arc-45 11.63,76.77 11.63,84.7 arc-90 13.63,86.7 17.23,86.7 arc90 18.23,87.7 J6.1
  Bottom 0.813: 29.81,14.63 IC8.4 | 30.62,14.6 30.63,14.6 31.02,14.6 arc45 31.37,14.75 31.38,14.76 arc45 31.53,15.11 v31.53,30.1 29.02,32.61 arc-45 28.58,33.67 28.58,38.55 arc90 26.83,40.3 v26.48,40.3 14.73,40.3 13.83,40.3 arc-90 12.33,41.8 12.33,42.03 arc90 10.83,43.53 J3.IOREF 8.83,43.53 arc-90 7.83,44.53 7.83,47.61 arc-90 8.83,48.61 J3.3V
5V0
  Top 0.15: J6.3 13.13,88.8
  Top 0.305: 26.58,91.92 25.44,93.06 arc45 25.09,93.2 24.23,93.2
  Top 0.406: J3.5V 8.33,51.15 arc-90 7.83,51.65 7.83,59.19 arc-45 8.12,59.9 10.54,62.31 arc45 10.83,63.02 10.83,83.76 arc-45 11.71,85.88 12.25,86.42 arc45 13.13,88.55 13.13,88.8 13.13,90.7 arc-90 15.63,93.2 24.23,93.2 | J3.5V@ISP 36.22,80.51 arc45 35.51,80.8 34.93,80.8 arc-90 33.93,81.8 33.93,87.65 arc90 32.93,88.65 29.68,88.65 arc-90 28.88,89.45 28.88,91.4 arc90 28.38,91.9 27.37,91.9 JP7.14 26.58,91.92
A63
  Bottom 0.15: TP24.TP 19.93,61.01 arc-45 20.29,61.15 IC1.89
A64
  Bottom 0.15: IC1.90 20.38,61.65 20.23,61.65 arc45 19.97,61.55 18.77,60.35 arc-45 18.42,60.2 17.74,60.2 arc45 17.38,60.06 TP23.TP
AD0
  Bottom 0.254: J3.A0 11.34,62.08 arc-45 11.78,61.02 11.78,58.9 arc90 15.03,55.65 IC1.78
AD1
  Bottom 0.254: J3.A1 10.54,65.43 arc-45 10.83,64.72 10.83,63.92 arc45 11.27,62.86 11.79,62.34 arc-45 12.23,61.28 12.23,58.95 arc90 15.03,56.15 IC1.79
AD2
  Bottom 0.254: IC1.80 15.03,56.65 arc-90 12.68,59 12.68,62.39 arc-45 12.97,63.1 13.34,63.46 arc45 13.63,64.17 13.63,64.64 arc45 13.34,65.35 9.63,69.05 9.63,68.87 J3.A2
AD3
  Bottom 0.254: IC1.81 15.03,57.15 arc-90 13.13,59.05 13.13,62.24 arc-45 13.42,62.95 13.79,63.31 arc45 14.08,64.02 14.08,64.89 arc45 13.79,65.6 11.12,68.26 arc-45 10.83,68.97 10.83,70.01 arc45 10.68,70.36 J3.A3
AD4
  Bottom 0.254: IC1.82 15.03,57.65 arc-90 13.58,59.1 13.58,62.09 arc-45 13.87,62.8 14.24,63.16 arc45 14.53,63.87 14.53,65 14.53,65.09 arc45 14.24,65.8 11.57,68.46 arc-45 11.28,69.17 11.28,70.85 arc45 11.13,71.2 10.97,71.36 arc-45 10.83,71.71 10.83,72.55 arc45 10.68,72.9 J3.A4
AD5
  Bottom 0.254: IC1.83 15.03,58.15 arc-90 14.03,59.15 14.03,61.94 arc-45 14.32,62.65 14.69,63.01 arc45 14.98,63.72 14.98,65.27 arc45 14.69,65.98 12.02,68.64 arc-45 11.73,69.35 11.73,71.05 arc45 11.58,71.4 11.42,71.56 arc-45 11.28,71.91 11.28,73.35 arc45 11.13,73.7 10.97,73.86 arc-45 10.83,74.21 10.83,75.09 arc45 10.68,75.44 J3.A5
ANT
  Bottom 1.27: JP3.TP IC3.8
AREF  (via drill 0.5)
  Top 0.254: v46.13,46.3 43.61,43.79 arc-45 42.2,43.2 35.14,43.2 arc-45 34.78,43.35 34.42,43.71 arc45 34.07,43.85 25.18,43.85 v24.93,44.1
  Bottom 0.15: SJ8.1
  Bottom 0.254: J3.AREF 56.77,37.98 arc-45 56.63,38.34 56.63,38.53 arc45 56.19,39.59 54.92,40.86 arc-45 54.48,41.92 54.48,42.3 arc90 52.98,43.8 51.94,43.8 arc-45 51.24,44.1 51.02,44.31 arc45 50.31,44.6 49.59,44.6 arc-45 48.89,44.9 48.57,45.21 arc45 47.86,45.5 46.94,45.5 arc-45 46.58,45.65 46.27,45.96 arc-45 v46.13,46.3 | v24.93,44.1 22.53,44.1 SJ8.1
AVREF
  Bottom 0.15: C119.2
  Bottom 0.254: IC1.75 20.93,54.15 C119.2 | L103.2 20.43,49.9 20.07,50.26 arc-45 19.93,50.61 19.93,53.45 arc-90 20.43,53.95 C119.2
BUTTON_A  (via drill 0.5)
  Top 0.15: S6.4 15.83,78.4 | 15.83,78.4 S6.3 14.47,74 S10.1 | 15.83,78.4 19.07,78.4 arc-45 19.42,78.26 19.78,77.9 arc-45 19.93,77.55 19.93,77.11 arc-45 19.78,76.76 19.57,76.55 arc45 19.43,76.2 19.43,71.41 arc-45 19.28,71.06 19.27,71.05 arc45 19.13,70.7 19.13,66.35 v18.83,66.05
  Bottom 0.15: v18.83,66.05 19.58,65.3 arc45 19.94,65.15 IC1.97
BUTTON_B  (via drill 0.5)
  Top 0.15: v19.93,66.15 19.57,66.51 arc-45 19.43,66.86 19.43,70.5 arc-45 19.57,70.85 19.58,70.86 arc45 19.73,71.21 19.73,76 arc-45 19.87,76.35 20.08,76.56 arc45 20.23,76.91 20.23,77.7 arc45 20.08,78.05 18.67,79.46 arc-45 18.52,79.81 S5.1 S5.2 19.88,87.8 S9.1
  Bottom 0.15: IC1.98 20.64,65.65 arc-45 20.28,65.8 v19.93,66.15
BUTTON_CENTER  (via drill 0.5)
  Top 0.15: S7.CTR 49.23,82.7 v47.93,82.7
  Bottom 0.15: IC1.8 44.47,67.15 arc45 44.82,67.3 45.28,67.76 arc-45 45.64,67.9 51.03,67.9 | 51.03,67.9 arc90 51.53,68.4 51.53,73.97 arc45 50.94,75.39 49.11,77.22 arc-45 48.53,78.63 48.53,81.9 arc45 48.38,82.25 v47.93,82.7 | R48.1 51.02,67.9 51.03,67.9
BUTTON_DOWN  (via drill 0.5)
  Top 0.15: S7.D 47.78,85.95 arc-45 47.93,85.6 v47.93,85.1
  Bottom 0.15: IC1.14 44.72,64.15 arc-45 44.82,64.11 arc45 44.96,64.05 51.33,64.05 arc90 52.13,64.85 52.13,74.27 arc45 51.54,75.69 49.71,77.52 arc-45 49.13,78.93 49.13,82.9 arc45 48.98,83.25 48.07,84.16 arc-45 47.93,84.51 v47.93,85.1
BUTTON_LEFT  (via drill 0.5)
  Top 0.15: S7.C 51.66,81.97 51.93,81.7 v52.93,82.7
  Bottom 0.15: IC1.16 44.52,63.15 arc45 44.87,63.3 44.88,63.31 arc-45 45.24,63.45 51.33,63.45 arc90 52.73,64.85 52.73,75.07 arc45 52.14,76.49 51.35,77.28 arc-90 51.35,78.27 52.34,79.27 arc45 52.93,80.68 v52.93,82.7
BUTTON_RESET
  Bottom 0.15: S4.1 S4.2 37.73,87.4 arc-90 39.23,85.9 39.23,84.6 arc90 39.73,84.1 SJ6.2
BUTTON_RIGHT  (via drill 0.5)
  Top 0.15: S7.B 45.98,84.15 arc45 46.33,84 v46.83,84
  Bottom 0.15: IC1.13 44.57,64.65 arc-45 44.92,64.51 44.93,64.5 arc45 45.29,64.35 51.33,64.35 arc90 51.83,64.85 51.83,74.12 arc45 51.24,75.54 49.41,77.37 arc-45 48.83,78.78 48.83,82.6 arc45 48.68,82.95 47.77,83.86 arc45 47.42,84 v46.83,84
BUTTON_UP  (via drill 0.5)
  Top 0.15: S7.A 49.98,80.15 v49.98,78.55
  Bottom 0.15: IC1.15 44.7,63.65 arc45 44.84,63.71 arc-45 44.94,63.75 51.33,63.75 arc90 52.43,64.85 52.43,74.95 arc45 51.84,76.36 49.98,78.23 v49.98,78.55
BUZZER+
  Bottom 0.15: R25.1 42.13,90.06 SG1.P$1
BUZZER_RES
  Bottom 0.15: R25.2 40.63,90.9 39.43,90.9 39.44,90.89 SJ7.1
C1
  Bottom 0.254: C28.2 43.88,17.85 IC7.10
CANRX0  (via drill 0.5)
  Top 0.254: JP5.2 56.77,78.04 arc45 56.63,77.69 56.63,76.76 arc-45 56.48,76.41 56.32,76.25 arc45 56.18,75.9 56.18,74.56 arc-45 56.03,74.21 55.87,74.05 arc45 55.73,73.7 55.73,72.91 arc-45 55.58,72.56 v54.83,71.8
  Bottom 0.254: IC1.24 44.93,59.15 arc90 45.88,60.1 45.88,60.3 arc-90 47.28,61.7 53.13,61.7 arc90 56.43,65 56.43,70 arc45 56.28,70.35 56.23,70.4 v54.83,71.8
CANTX0  (via drill 0.5)
  Top 0.254: JP5.1 56.67,80.48 arc45 56.53,80.13 56.53,79.11 arc-45 56.38,78.76 56.32,78.7 arc45 56.18,78.35 56.18,76.91 arc-45 56.03,76.56 55.87,76.4 arc45 55.73,76.05 55.73,74.76 arc-45 55.58,74.41 55.42,74.25 arc45 55.28,73.9 55.28,73.86 arc-45 55.13,73.51 v53.83,72.2
  Bottom 0.254: IC1.23 44.93,59.65 arc90 45.43,60.15 45.43,60.3 arc-90 47.28,62.15 53.13,62.15 arc90 55.98,65 55.98,69.15 arc45 55.83,69.5 53.97,71.36 arc-45 53.83,71.71 v53.83,72.2
D22
  Bottom 0.15: IC1.1 45.43,70.65 TP4.TP
D23
  Bottom 0.15: IC1.7 44.52,67.65 arc45 44.87,67.8 45.13,68.06 arc-45 45.49,68.2 49.72,68.2 arc45 50.07,68.35 TP10.TP
D33
  Bottom 0.15: IC1.55 32.88,50.34 arc45 32.94,50.19 33.02,50.11 arc-45 33.08,49.97 33.08,46.71 arc-45 32.93,46.36 32.83,46.25 arc-45 31.99,45.9 arc45 31.63,45.76 TP25.TP
D51
  Bottom 0.15: IC1.94 20.04,63.65 arc45 19.68,63.51 19.35,63.17 arc45 19.2,62.82 19.2,61.53 arc-45 19.06,61.18 18.52,60.65 arc-45 18.17,60.5 16.54,60.5 arc45 16.18,60.36 TP22.TP
DAC0  (via drill 0.5)
  Top 0.254: v8.33,62.1 8.33,77.65 arc-45 8.47,78 JP4.2 8.47,80.19 arc-45 8.33,80.54 8.33,87.87 arc-45 8.91,89.29 9.98,90.36 arc-45 10.34,90.5 10.42,90.5 arc45 10.77,90.65 14.96,94.83 arc-45 17.79,96 29.83,96 arc-90 31.33,94.5 v31.33,92.9
  Bottom 0.254: IC1.76 14.98,54.65 arc-90 10.83,58.8 10.83,60.67 arc45 10.42,61.66 arc45 9.36,62.1 v8.33,62.1 | v31.33,92.9 36.43,92.9 arc-90 38.43,90.9 SJ7.2
  Bottom 0.406: SJ7.2
DAC1
  Bottom 0.254: JP4.1 8.47,80.54 arc45 8.33,80.19 8.33,63.6 arc90 9.33,62.6 9.51,62.6 arc-45 10.57,62.16 10.89,61.84 arc-45 11.33,60.78 11.33,58.85 arc90 15.03,55.15 IC1.77
DFSD_N
  Bottom 0.254: IC1.43 38.88,51.9 arc-90 40.18,53.2 42.13,53.2 arc-90 43.33,52 43.33,50.5 R105.2
DFSD_P
  Bottom 0.254: IC1.42 39.38,49.53 arc-45 39.23,49.18 39.2,49.15 arc45 39.06,48.8 39.06,46.1 arc90 39.63,45.53 40.36,45.53 arc90 40.83,46 40.83,46.99 arc-90 R106.2
DHSD_N
  Bottom 0.254: J1.D- 54.23,25.65 arc-27 Z2.1 arc-23 49.58,25.68 arc2 49.42,25.68 arc49 46.38,24.21 arc-50 43.23,22.73 arc-90 41.16,24.8 41.16,43.86 arc-45 41.3,44.21 42.38,45.3 arc45 42.53,45.65 42.53,50.3 42.63,50.4 | 42.63,50.4 42.63,51.95 arc178 41.38,51.95 IC1.38 | 42.63,50.4 42.63,50.31 R105.1
DHSD_P
  Bottom 0.254: J1.D+ 54.23,25 arc27 Z1.1 arc21 49.57,25.03 arc2 49.43,25.03 arc49 46.88,23.79 arc-50 43.23,22.08 arc-90 40.5,24.8 40.5,32.9 arc90 39.87,33.53 39.22,33.53 arc-90 38.59,34.16 38.59,34.75 arc-90 39.22,35.38 39.87,35.38 arc90 40.5,36 40.5,44.13 arc-45 40.65,44.48 41.73,45.57 arc45 41.88,45.92 41.88,47 | 41.88,47 IC1.37 | R106.1 41.88,47
DTR
  Bottom 0.15: C29.2 64.12,66.4 arc-45 64.47,66.26 JP6.6
EEXTINT  (via drill 0.5)
  Top 0.15: JP7.11 25.94,88.25 arc45 26.29,88.1 27.43,88.1 arc-90 28.93,86.6 28.93,83.21 arc45 29.07,82.86 29.44,82.5 arc-45 29.73,81.79 29.73,80.51 arc-45 29.58,80.16 arc45 29.48,79.91 29.48,70.96 arc-45 29.33,70.61 28.77,70.05 arc45 28.63,69.7 28.63,66.85 v28.93,66.55 | v30.13,57.8 arc-45 31.21,58.25 32.47,58.25 arc-45 32.82,58.11 33.58,57.35 arc45 33.94,57.2 41.02,57.2 arc45 41.37,57.35 v42.53,58.5
  Bottom 0.15: v28.93,66.55 30.03,66.55 arc-90 30.53,66.05 30.53,58.41 arc-45 30.38,58.06 v30.13,57.8 | v42.53,58.5 42.68,58.65 IC1.25
EMDC  (via drill 0.5)
  Top 0.15: JP7.5 25.92,80.65 arc45 26.27,80.5 27.77,80.5 arc-45 28.12,80.36 28.48,80 arc-45 28.63,79.65 28.63,78.31 arc45 28.77,77.96 arc-45 28.88,77.71 28.88,71.81 arc-45 28.73,71.46 v28.08,70.8
  Bottom 0.15: IC1.123 31.38,72.2 arc-90 30.38,71.2 28.69,71.2 arc45 28.33,71.06 v28.08,70.8
EMDIO  (via drill 0.5)
  Top 0.15: JP7.7 25.81,83.3 arc45 26.52,83 27.61,83 arc-45 28.32,82.71 28.44,82.6 arc-45 28.73,81.89 v28.73,80.8 | v30.18,78.95 29.92,78.7 arc45 29.78,78.35 29.78,74.7 arc90 30.28,74.2 v34.03,74.2
  Bottom 0.15: v28.73,80.8 28.73,80.61 arc45 28.87,80.26 v30.18,78.95 | IC1.127 33.38,73.35 arc-45 33.52,73.7 v34.03,74.2
ERASE_CMD
  Bottom 0.15: SJ2.2 12.73,16.28 12.9,16.1 R41.1 12.98,15.43 Q8.1
ERASE_S  (via drill 0.5)
  Top 0.15: v11.63,16 12.48,16.86 arc45 12.63,17.21 12.63,30.3 arc-45 13.8,33.12 14.06,33.38 arc45 15.23,36.21 15.23,38.7 arc45 15.08,39.05 12.47,41.66 arc-45 12.33,42.01 12.33,43.3 | 12.33,43.3 11.02,44.61 arc45 10.31,44.9 7.04,44.9 arc-45 6.68,45.05 JP1.1 | 12.33,43.3 v12.33,44.8 | v24.93,48.5 25.33,48.91 arc45 25.48,49.26 25.48,51.45 arc45 25.33,51.8 24.92,52.21 arc-45 24.78,52.56 24.78,52.75 arc-45 24.92,53.1 25.08,53.26 arc45 25.23,53.61 25.23,53.9 arc-45 25.37,54.25 25.78,54.66 arc-45 26.14,54.8 26.87,54.8 arc45 27.22,54.95 27.33,55.06 arc-45 27.69,55.2 27.72,55.2 arc45 28.07,55.35 28.28,55.56 arc45 28.43,55.91 28.43,57.2 29.34,58.11 arc-45 30.4,58.55 32.55,58.55 arc-45 33.96,57.97 v34.03,57.9
  Bottom 0.15: IC1.130 34.88,71.95 34.93,71.9 34.93,69.91 arc45 35.07,69.56 35.08,69.55 arc-45 35.23,69.2 35.23,67.12 arc45 35.52,66.41 35.69,66.25 arc-45 35.98,65.54 35.98,63.77 arc-45 35.69,63.06 35.42,62.8 arc45 35.13,62.09 35.13,61.82 arc-45 34.84,61.11 34.72,61 arc45 34.58,60.65 34.58,58.66 arc-45 34.43,58.31 v34.03,57.9 | v12.33,44.8 arc90 13.33,43.8 15.86,43.8 arc-45 16.57,43.51 18.03,42.05 arc45 18.39,41.9 22.98,41.9 arc90 25.68,44.6 25.68,46.9 arc45 25.61,47.08 25.55,47.13 arc-45 25.48,47.31 25.48,47.75 arc45 25.33,48.1 v24.93,48.5 | v11.63,16 12.08,15.55 arc-45 12.23,15.2 12.23,14.81 arc45 12.37,14.46 13.43,13.4 Q8.3
ERX_DV
  Bottom 0.15: JP7.4 28.28,79.22 arc-90 28.78,78.72 28.78,77.22 arc45 29.04,76.6 arc-45 29.33,75.89 29.33,73.59 arc45 29.36,73.52 arc-45 29.38,73.47 IC1.119
ERX_ER  (via drill 0.5)
  Top 0.15: JP7.3 25.93,78.1 arc45 26.28,77.95 27.58,77.95 arc-90 28.58,76.95 28.58,72 arc-90 28.08,71.5 27.64,71.5 arc45 27.28,71.36 v27.03,71.1
  Bottom 0.15: IC1.122 30.88,72.2 arc-90 30.18,71.5 27.64,71.5 arc45 27.28,71.36 v27.03,71.1
ERXD0
  Bottom 0.15: JP7.6 27.35,80.9 27.73,80.52 arc45 27.77,80.5 arc-45 28.12,80.36 28.93,79.55 arc-45 29.08,79.2 29.08,77.37 arc45 29.34,76.75 arc-45 29.63,76.04 29.63,73.91 arc45 29.77,73.56 arc-45 29.88,73.31 IC1.120
ERXD1  (via drill 0.5)
  Top 0.15: JP7.1 25.94,75.55 arc45 26.29,75.4 27.28,75.4 arc-90 28.28,74.4 28.28,72.3 arc-90 27.78,71.8 26.69,71.8 arc45 26.33,71.66 v25.98,71.3
  Bottom 0.15: IC1.121 30.38,72.3 arc-90 29.88,71.8 26.69,71.8 arc45 26.33,71.66 v25.98,71.3
ETX_CLK
  Bottom 0.15: IC1.113 26.38,73.25 25.57,74.06 arc-45 25.43,74.41 25.43,74.6 arc90 24.93,75.1 24.23,75.1 arc-90 23.23,76.1 23.23,83.15 arc-45 23.37,83.5 23.38,83.51 arc45 23.53,83.86 23.53,84.55 arc-90 24.53,85.55 25.08,85.55 arc90 26.08,86.55 26.08,87.9 arc-45 26.22,88.26 JP7.12
ETX_EN
  Bottom 0.15: JP7.10 27.35,86.77 26.27,85.7 arc45 26.13,85.35 26.13,84.05 arc-90 25.13,83.05 24.53,83.05 arc90 23.53,82.05 23.53,76.1 arc90 24.23,75.4 24.93,75.4 arc-90 25.73,74.6 25.73,74.56 arc45 25.87,74.21 26.38,73.7 arc-90 26.88,73.2 IC1.114
ETXD0
  Bottom 0.15: IC1.115 27.38,73.3 arc45 27.23,73.65 26.98,73.9 arc45 26.74,74 arc-45 26.38,74.15 26.17,74.36 arc-45 26.03,74.71 26.03,75.35 26.08,75.4 26.08,82.62 arc-45 26.37,83.32 JP7.8
ETXD1
  Bottom 0.15: JP7.2 28.03,76.68 arc-90 29.03,75.68 29.03,74.14 arc-45 29,74.07 28.91,73.98 arc45 28.88,73.91 IC1.118
FLASH_CS  (via drill 0.5)
  Top 0.15: v22.78,74.3 22.03,74.3 arc90 21.03,73.3 v21.03,72.4
  Bottom 0.15: v21.03,72.4 18.23,72.4 IC5.1 | IC1.111 25.38,73.15 arc45 25.23,73.5 24.97,73.76 arc45 24.62,73.9 23.59,73.9 arc-45 22.89,74.2 v22.78,74.3
FLASH_HOLD  (via drill 0.5)
  Top 0.15: v18.73,75.5 18.98,75.25 arc-45 19.13,74.9 19.13,71.56 arc-45 18.98,71.21 18.97,71.2 arc45 18.83,70.85 18.83,67.26 arc-45 18.68,66.91 17.77,66 arc45 17.63,65.65 17.63,64.31 arc45 17.77,63.96 v18.03,63.7
  Bottom 0.15: IC1.96 19.19,64.65 arc45 18.83,64.51 v18.03,63.7 | v18.73,75.5 18.52,75.71 arc-45 18.38,76.06 18.38,76.7 arc45 18.23,77.05 17.77,77.51 arc-45 17.63,77.86 17.63,78.46 arc90 17.13,78.96 IC5.7
FTDI_PWR
  Top 0.406: JP6.3 64.43,72.62 arc90 63.43,71.62 SJ9.1
  Bottom 0.308: C38.2 64.02,74 arc-45 64.37,73.86 65.52,72.71 arc45 JP6.3
FWUP
  Bottom 0.15: R104.1 32.53,45.5 33.23,46.21 arc45 33.38,46.56 33.38,48.21 arc-45 33.48,48.46 arc45 33.63,48.81 33.63,49.9 arc-45 33.77,50.25 33.82,50.29 arc45 33.88,50.44 IC1.53
GND  (via drill 0.5)
  Bottom 0.15: IC7.11 44.38,17.05 44.73,17.4 44.73,18.25 v43.93,19.05 43.93,18.95 43.28,18.3 43.28,16.5 43.38,16.4 IC7.9 | 16.73,1.2 16.73,1.21 R14.2 16.68,1.25
  other vias: 11.43,33.9 11.43,31.9 11.43,29.9 11.43,27.9 11.43,25.9 11.43,23.9 13.73,35.3 12.53,35.3 11.43,35.3 11.43,38.5 12.53,38.5 13.63,38.5 11.43,22.2 11.33,20.4 11.63,17.1 5.23,7.1 11.43,39.9 11.28,42.1 2.43,42.5 4.43,42.5 6.43,42.5 8.43,42.5 2.53,15.4 6.73,15.4 3.43,97.4 7.43,83.5 30.58,75 33.38,75.4 33.18,71.45 48.38,65.05 42.53,65.15 29.18,56.95 42.63,54.65 37.88,52.5 39.88,55.35 31.38,52.35 23.58,54.35 20.78,52.05 23.63,70 20.88,69.95 11.88,90.4 11.63,6.4 15.93,26.2 35.48,8.5 24.68,13.1 20.08,15.9 20.08,14.9 19.18,15.4 26.38,15.9 23.38,15.9 29.53,4.15 8.98,9.85 7.08,13.55 4.08,10.05 14.73,76.1 13.08,76.25 27.73,48.4 27.58,41.45 34.68,46.9 39.43,44.65 32.03,46.6 26.33,59.05 46.88,49.75 48.13,54.8 33.63,2.45 30.48,10.6 25.48,4.5 36.23,10.2 41.13,10.25 36.33,17.25 41.53,15.8 9.53,91.1 13.08,77.85 13.33,71.1 12.68,83.3 17.18,81 19.33,92.2 9.18,83.5 16.98,97 4.28,93.7 19.48,98.3 27.58,98.3 19.98,94.6 38.83,97.4 45.78,98.8 57.88,90 51.48,84.9 46.68,85.2 65.13,82.7 32.98,86.7 34.88,86.7 20.38,83.9 18.68,19.6 24.58,18.3 19.58,25.5 23.68,25.9 23.88,39.2 10.93,47.3 40.68,3.15 59.28,60.45 55.33,54.1 59.38,52.65 65.98,61.95 63.88,53.75 6.73,6.95 15.43,8.8 60.68,13.6 56.63,15.1 39.93,46.45 25.18,28.9 21.48,25.5 23.28,23 37.88,46.8 56.23,30 54.38,31.85 49.18,37.15 59.78,18.6 57.08,19.2 58.83,33.1 53.93,23.1 44.23,47.7 6.63,55.1 21.88,42.95 5.73,52.2 47.18,44.75 26.88,21.6 46.08,16.65 54.93,39.4 53.03,38.25 52.03,41.5 49.33,59 38.18,58.95 58.88,48.3 53.18,43 58.88,55.75 36.23,40.05 30.58,80.4 36.18,74.4 47.08,80.5 48.28,76 40.13,79.9 24.88,45.55 8.23,49.95 3.33,45.7 38.18,64.25 18.38,31.6 29.08,40.6 19.48,23 27.53,38.5 32.18,36.8 34.83,17.15 24.58,32.8 21.88,32.75 27.68,55.95 38.58,61.25 28.18,63.95 18.08,68 13.48,72.3 15.28,62.1 23.58,56.55 20.63,59.95 24.08,64.65 26.58,57.55 33.73,56.45 25.68,65.65 23.28,71.85 22.08,75.65 20.63,78.6 56.88,0.9 64.08,4.5 62.03,8.1 53.48,11 56.08,32.5 52.48,35.8 59.58,44.95 58.88,67.65 59.38,73.45 60.63,82.6 54.48,75.55 39.68,87.35 26.48,69.35 59.33,76.1 29.78,89.55 43.18,95.85 33.28,97.75 43.18,98.9 14.58,91.7 23.43,91.1 23.43,88.1 41.28,94.35 32.18,93.75 9.18,87.5 16.48,84.2 48.28,52.55 57.48,84.05 43.48,34.05 29.63,42.3 29.48,44.6 18.33,65.05 11.98,54.85 31.78,33.7 34.43,25.35 35.28,36.6 35.38,35.1 49.13,14.3 48.88,16.4 46.98,21.9 45.08,21.4 42.13,21 46.83,25.8 42.18,30.4 37.08,33.9 39.58,36.3 42.38,35.7 42.13,41.65 45.68,43.4 39.58,41.5 33.18,14.1 18.93,12.7 26.58,10.6 26.98,3.2 22.68,10.8 39.53,28.2 21.48,71.4 53.38,57.75 42.08,27.4 29.93,22.1 50.33,12 48.78,11.4 17.88,18.1 16.08,18.7 18.38,35.3 47.93,59.15 55.53,61.75 50.33,67.1 17.68,76.55 55.38,41.6 53.13,16.7 20.88,1
  pour Bottom: -0.07,100 59.93,100 arc-52 63.93,50 arc52 67.93,0 31.43,0 7.93,0 arc-52 3.93,50 arc52
  pour Top: -0.07,100 59.93,100 arc-52 63.93,50 arc52 67.93,0 7.93,0 arc-52 3.93,50 arc52
HMC_DRDY  (via drill 0.5)
  Top 0.15: v47.53,15 48.33,15 arc90 51.33,18 51.33,51.57 arc45 50.74,52.99 49.71,54.02 arc-45 49.13,55.43 49.13,56.6 arc45 48.98,56.95 48.77,57.16 arc-45 48.63,57.51 48.63,59.15 arc90 47.63,60.15 43.29,60.15 arc45 42.93,60.01 v42.58,59.65
  Bottom 0.15: IC7.15 46.36,14.25 arc45 47.07,14.55 v47.53,15 | v42.58,59.65 43.08,60.15 IC1.22
IR_RX  (via drill 0.5)
  Top 0.15: v15.93,64.2 15.15,64.98 arc-45 13.79,68.26 IR_RX.3 | v17.63,62.25 17.63,59.1 arc-90 15.73,57.2 14.93,57.2 arc90 13.33,55.6 13.33,47.36 arc45 13.47,47.01 13.78,46.7 arc-45 13.93,46.35 13.93,43.86 arc45 14.07,43.51 15.03,42.55 arc-45 15.13,42.31 arc45 15.27,41.96 v15.53,41.7
  Bottom 0.15: v15.53,41.7 arc90 15.93,41.3 22.98,41.3 arc90 26.28,44.6 26.28,47.25 arc45 26.21,47.43 26.2,47.43 arc-45 26.13,47.61 26.13,48.55 arc45 25.98,48.9 25.02,49.86 arc-45 24.88,50.21 IC1.71 | v15.93,64.2 17.63,62.5 v17.63,62.25
IR_RX_PWR
  Bottom 0.15: IC1.95 19.79,64.15 arc45 19.43,64.01 18.63,63.2 arc-45 18.14,63 arc-45 17.44,63.3 17.32,63.41 arc-45 17.03,64.12 17.03,65.04 arc90 16.03,66.04 R49.2 15.87,67.52 Q13.1
IR_TX_A  (via drill 0.5)
  Top 0.305: v59.43,2.5 IR_TX.A
  Bottom 0.305: R4.1 59.43,4.3 v59.43,2.5
IR_TX_C  (via drill 0.5)
  Top 0.305: IR_TX.C v59.43,8
  Bottom 0.254: Q9.3 57.13,8
  Bottom 0.305: v59.43,8 57.13,8
IR_TX_PWM
  Bottom 0.15: SJ4.1 60.95,6.2 60.95,6.18 | 58.93,6.18 R40.1
  Bottom 0.305: Q9.1 58.93,6.18 | 58.93,6.15 58.93,6.18 | 58.93,6.18 60.95,6.18
ISP_!RESET  (via drill 0.5)
  Top 0.15: J3.!RESET@ISP 32.46,76.68 33.53,77.76 arc45 33.68,78.11 33.68,79.65 arc45 33.53,80 33.02,80.51 arc-45 32.88,80.86 v32.88,82.15
  Bottom 0.15: v32.88,82.15 34.98,82.15 35.28,82.45 35.28,84.21 arc45 35.17,84.46 arc-45 35.03,84.81 35.03,85.2 arc-90 35.53,85.7 38.43,85.7 arc-90 38.93,85.2 38.93,83.1 arc90 39.43,82.6 41.13,82.6 arc-90 42.83,80.9 arc45 42.9,80.73 43.33,80.3 SJ3.2 SJ3.1 46.06,79.41 Q10.3
ISP_!RESET!_IO
  Bottom 0.15: IC1.140 39.88,73.4 arc-90 40.98,74.5 45.53,74.5 arc90 46.48,75.45 R42.1 46.47,77.11 arc-45 46.62,77.47 Q10.1 46.78,77.65
JTAG_RESET
  Bottom 0.15: R7.1 R24.1 JP2.10
JTAG_TCK  (via drill 0.5)
  Top 0.15: JP2.4 61.86,59.34 arc-45 60.8,58.9 v59.73,58.9
  Bottom 0.15: R22.1 JP2.4 | IC1.28 45.83,57.15 arc90 46.33,57.65 46.33,59.9 arc-90 47.73,61.3 54.32,61.3 arc-45 54.67,61.16 55.63,60.2 arc45 55.99,60.05 58.37,60.05 arc-45 58.72,59.91 v59.73,58.9
JTAG_TDI  (via drill 0.5)
  Top 0.15: JP2.8 61.84,57.63 arc45 61.48,57.49 60.59,56.6 arc-45 60.24,56.45 57.04,56.45 arc-45 56.68,56.6 56.02,57.26 arc-45 55.73,57.97 55.73,58.1 arc-45 55.87,58.45 55.93,58.51 arc45 56.08,58.86 v56.08,59.3
  Bottom 0.15: R23.1 JP2.8 | IC1.29 44.65,56.65 arc45 44.78,56.71 arc-45 45.14,56.85 45.83,56.85 arc90 46.63,57.65 46.63,59.9 arc-90 47.73,61 53.83,61 arc-90 55.03,59.8 arc90 55.53,59.3 v56.08,59.3
JTAG_TDO  (via drill 0.5)
  Top 0.15: JP2.6 62.25,58.9 arc45 61.19,58.46 59.62,56.9 arc-45 59.27,56.75 57.79,56.75 arc-45 57.43,56.9 v56.43,57.9
  Bottom 0.15: IC1.30 44.52,56.15 arc45 44.87,56.3 44.98,56.41 arc-45 45.34,56.55 45.83,56.55 arc90 46.93,57.65 46.93,59.9 arc-90 47.73,60.7 52.58,60.7 arc-90 55.08,58.2 arc90 55.38,57.9 v56.43,57.9
JTAG_TMS  (via drill 0.5)
  Top 0.15: JP2.2 61.15,59.9 arc-45 60.44,59.6 59.83,59.6 59.73,59.6 59.53,59.6 arc90 59.03,59.1 v59.03,57.6 59.03,58.5
  Bottom 0.15: R21.1 JP2.2 | v59.03,57.6 58.77,57.35 arc-45 58.42,57.2 55.78,57.2 arc-90 54.78,58.2 arc90 52.58,60.4 47.73,60.4 arc90 47.23,59.9 47.23,57.65 arc-90 45.83,56.25 45.54,56.25 arc45 45.18,56.11 44.87,55.8 arc-45 44.52,55.65 IC1.31
LCD_3V3
  Bottom 0.15: 48.33,38.2 SJ11.1 Q11.3
  Bottom 0.254: J7.6 44.29,39.25 arc45 43.93,39.11 43.83,39 | 43.83,39 43.83,39.25 arc-90 44.33,39.75 J7.5 46.42,39.75 arc45 46.77,39.9 46.81,39.93 arc-45 47.16,40.08 Q11.3 | 43.83,39 43.83,34.95 | 43.83,34.95 43.13,34.95 arc90 42.63,34.45 42.63,34.38 arc45 43.21,32.97 43.24,32.94 arc-45 43.83,31.52 43.83,28.75 arc90 44.33,28.25 J7.28 | J7.15 44.24,34.75 arc-45 43.88,34.9 43.83,34.95
LCD_!CS  (via drill 0.5)
  Top 0.15: v25.48,62.65 25.78,62.35 arc-45 25.93,62 arc-45 25.4,60.73 25.16,60.49 arc-45 23.75,59.9 23.36,59.9 arc45 21.94,59.32 20.91,58.29 arc45 20.33,56.87 20.33,56.5 arc-90 18.33,54.5 arc90 16.03,52.2 16.03,49.86 arc45 16.17,49.51 16.48,49.2 arc-45 16.63,48.85 16.63,47.51 arc45 16.77,47.16 17.58,46.35 arc-45 17.73,46 17.73,45.61 arc45 17.87,45.26 19.38,43.75 arc-45 19.53,43.4 19.53,38.5 arc90 22.73,35.3 24.73,35.3 arc-90 28.93,31.1 28.93,29.3 arc90 36.63,21.6 38.68,21.6 arc90 46.38,29.3 46.38,35.45 arc-45 46.52,35.8 47.18,36.46 arc45 47.33,36.81 47.33,40.75 arc90 46.83,41.25 v46.28,41.25
  Bottom 0.15: IC1.92 v25.48,62.65 | J7.2 v46.28,41.25
LCD_!RST  (via drill 0.5)
  Top 0.15: v30.38,37.8 30.58,37.6 arc-45 30.73,37.25 30.73,29.4 arc90 36.73,23.4 38.58,23.4 arc90 44.58,29.4 44.58,37.3 arc45 44.43,37.65 v43.08,39
  Bottom 0.15: IC1.59 30.88,50.56 arc-45 30.73,50.21 30.72,50.2 arc45 30.58,49.85 30.58,49.2 arc-45 30.47,48.95 arc45 30.33,48.6 30.33,45.57 arc45 30.62,44.86 30.69,44.8 arc-45 30.98,44.09 30.98,40.31 arc-45 30.83,39.96 30.27,39.4 arc45 30.13,39.05 30.13,38.05 v30.38,37.8 | v43.08,39 43.03,39 42.52,39.51 arc-45 42.38,39.86 42.38,40.45 arc-90 42.88,40.95 43.22,40.95 arc-45 43.57,40.81 arc45 43.7,40.75 J7.3
LCD_A0  (via drill 0.5)
  Top 0.15: v29.93,36.75 30.28,36.4 arc-45 30.43,36.05 30.43,29.4 arc90 36.73,23.1 38.58,23.1 arc90 44.88,29.4 44.88,38.25 arc45 44.73,38.6 v43.08,40.25
  Bottom 0.15: IC1.64 28.38,50.26 arc-45 28.23,49.91 27.17,48.85 arc45 27.03,48.5 27.03,48.11 arc45 27.1,47.93 27.11,47.93 arc-45 27.18,47.75 27.18,45.6 arc90 27.68,45.1 28.7,45.1 arc45 28.92,45.19 28.94,45.21 arc-45 29.15,45.3 29.68,45.3 arc-90 30.18,44.8 30.18,43.06 arc45 30.32,42.71 arc-45 30.43,42.46 30.43,40.26 arc-45 30.28,39.91 29.72,39.35 arc45 29.58,39 29.58,37.31 arc45 29.72,36.96 v29.93,36.75 | J7.4 v43.08,40.25
LCD_A_SWITCHED
  Bottom 0.15: R45.2 55.25,16.08 Q12.3
LCD_BACKLIGHT  (via drill 0.5)
  Top 0.15: v33.53,53.55 36.67,53.55 arc45 37.02,53.7 37.03,53.71 arc-45 37.39,53.85 48.1,53.85 arc-45 49.51,53.27 50.14,52.64 arc-45 50.73,51.22 50.73,19.71 arc-45 50.58,19.36 v50.33,19.1
  Bottom 0.15: v50.33,19.1 arc45 50.93,18.85 51.71,18.85 arc-45 52.42,18.56 53.64,17.35 arc-45 53.93,16.64 arc-45 53.76,16.24 53.72,16.2 arc-45 53.01,15.9 52.53,15.9 arc90 51.53,14.9 arc90 52.17,14.26 R43.1 53.2,14.26 Q12.1 | IC1.60 30.38,52.65 arc-45 30.52,53 30.68,53.16 arc45 30.83,53.51 30.83,55.55 arc-90 31.53,56.25 arc-90 32.23,55.55 32.23,55.27 arc45 32.52,54.56 v33.53,53.55
LCD_P1+
  Bottom 0.15: C41.2 48.56,32.85 arc-45 48.21,32.7 46.79,32.7 arc45 46.43,32.56 46.27,32.4 arc-45 45.92,32.25 J7.20
LCD_P1-
  Bottom 0.15: J7.19 45.97,32.75 arc45 46.32,32.9 46.78,33.36 arc-45 47.14,33.5 C41.1 47.83,33.5 arc90 48.33,34 48.33,34.35 arc-90 48.83,34.85 C40.1
LCD_P2+
  Bottom 0.15: C42.2 46.41,31.9 arc45 46.27,31.84 46.24,31.81 arc-45 46.1,31.75 J7.21
LCD_P2-
  Bottom 0.15: C42.1 48.56,31.25 arc-45 48.21,31.1 46.31,31.1 arc-45 46.17,31.16 46.14,31.19 arc45 46,31.25 J7.22
LCD_P3+
  Bottom 0.15: C40.2 47.44,34.71 46.87,34.14 arc45 46.73,33.8 46.32,33.4 arc-45 45.97,33.25 J7.18
LCD_POWER  (via drill 0.5)
  Top 0.15: v46.93,42.7 46.89,42.7 arc45 46.53,42.56 45.32,41.35 arc45 45.18,41 45.18,29.4 arc-90 38.58,22.8 36.73,22.8 arc-90 30.13,29.4 30.13,34.4 arc45 29.98,34.75 29.77,34.96 arc-45 29.63,35.31 v29.63,35.7
  Bottom 0.15: IC1.66 27.38,49.76 arc-45 27.23,49.41 26.87,49.05 arc45 26.73,48.7 26.73,47.96 arc45 26.8,47.78 26.81,47.78 arc-45 26.88,47.6 26.88,44.06 arc45 27.02,43.71 29.18,41.55 arc45 29.54,41.4 29.63,41.4 arc-90 30.13,40.9 30.13,40.41 arc-45 29.98,40.06 29.37,39.45 arc45 29.23,39.1 29.23,36.31 arc45 29.37,35.96 v29.63,35.7 | v48.33,41 47.68,41.65 Q11.1 47.88,42.13 R44.1 47.78,42.7 v46.93,42.7
LCD_V0
  Bottom 0.15: J7.27 45.63,28.75 arc-90 46.13,28.25 46.13,27.91 arc45 46.27,27.56 46.73,27.1 arc45 47.09,26.95 C47.2
LCD_V1
  Bottom 0.15: C46.2 47.08,28.3 46.27,29.11 arc45 45.92,29.25 J7.26
LCD_V2
  Bottom 0.15: C45.2 47.39,29.75 J7.25
LCD_V3